# EAGLE design 18ch_connector (EAGLE 6.5.0)
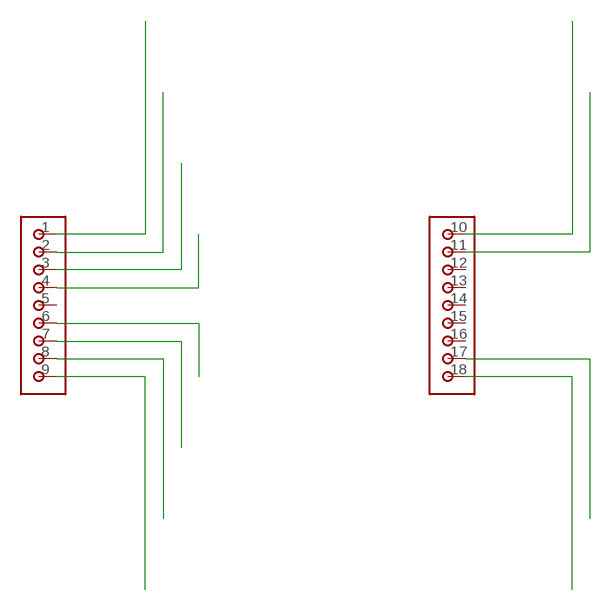
[diagram p0: schematic, sheet 1]

## Parts
X1  OMNETIC_18PAD  [OMNETICS18PADSMT]

## Nets
N$2: X1.4
N$3: X1.3
N$4: X1.2
N$5: X1.1
N$6: X1.6
N$7: X1.7
N$8: X1.8
N$9: X1.9
N$13: X1.11
N$14: X1.10
N$17: X1.17
N$18: X1.18
Unconnected: X1.5 X1.12 X1.13 X1.14 X1.15 X1.16

## Library data of the parts
X1 = mor307:OMNETIC_18PAD

## Board
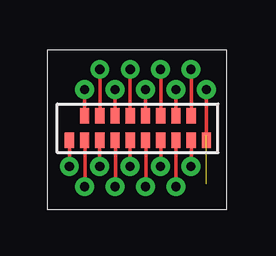
[diagram p1: board, top side]
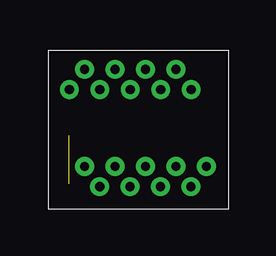
[diagram p2: board, bottom side, seen from below]

No outline drawn. Coordinates in mm, seen from the top.
Copper layers (1*16): Top 0.035mm / dielectric 1.5mm / Bottom 0.035mm
Design rules "default": minimum track width 10mil, minimum drill 24mil, track to track 8mil, track to pad 8mil, pad to pad 8mil, via to via 8mil, smd to smd 8mil, copper to edge 40mil, drill to drill 8mil, minimum pad ring 10mil, minimum via ring 8mil, stop-mask expansion 4mil, vias tented up to drill 0mil, thermal gap 10mil

### Footprints (pad centres in the part's own frame; a part is rotated, then mirrored left to right if it is on the bottom)
OMNETICS18PADSMT = smd 0.381 x 0.635: 1 -2.857,-0.508; 2 -2.223,-0.508; 3 -1.587,-0.508; 4 -0.953,-0.508; 5 -0.318,-0.508; 6 0.318,-0.508; 7 0.953,-0.508; 8 1.587,-0.508; 9 2.223,-0.508; 10 2.857,-0.508; 11 -2.223,0.508; 12 -1.587,0.508; 13 -0.953,0.508; 14 -0.318,0.508; 15 0.318,0.508; 16 0.953,0.508; 17 1.587,0.508; 18 2.223,0.508

### Placement (x,y rotation side)
X1  3.78,3.41 0 top

### Tracks (layer width: path | path; a pad name or v marks a point on that pad's centre or on a via)
N$1  (via drill 0.38)
  other vias: 0.92,1.81 2.19,1.81 1.56,0.96 2.83,0.96 4.1,0.96 5.37,0.96 6.64,5.01
N$10  (via drill 0.38)
  other vias: 3.46,1.81 4.73,1.81 6,1.81
N$11
  Top 0.152: 0.94,1.81 0.94,2.95 | 2.18,1.86 2.18,3 | 3.45,1.86 3.45,3 | 4.75,1.86 4.75,3 | 6.02,1.83 6.02,2.97 | 1.57,3.85 1.57,4.99 | 2.83,3.86 2.83,5 | 4.09,3.86 4.09,5 | 5.38,3.85 5.38,4.99
N$12  (1 unrouted)
  Top 0.152: 1.57,0.94 1.57,2.97 | 2.84,0.99 2.84,3.02 | 4.11,0.99 4.11,3.02 | 5.38,0.99 5.38,3.02 | 2.21,3.81 2.21,5.84 | 3.46,3.81 3.46,5.85 | 4.75,3.81 4.75,5.85 | 6.01,3.81 6.01,5.84
N$15  (via drill 0.38)
  other vias: 1.56,5.01
N$16  (via drill 0.38)
  other vias: 2.83,5.01
N$19  (via drill 0.38)
  other vias: 4.1,5.01
N$20  (via drill 0.38)
  other vias: 5.37,5.01
N$21
  Top 0.152: 6.64,5.01 6.64,3.05
N$22  (via drill 0.38)
  other vias: 2.19,5.86
N$23  (via drill 0.38)
  other vias: 3.46,5.86
N$24  (via drill 0.38)
  other vias: 4.73,5.86
N$25  (via drill 0.38)
  other vias: 6,5.86